# EAGLE design LedEsp32_rev1 (EAGLE 9.6.2)
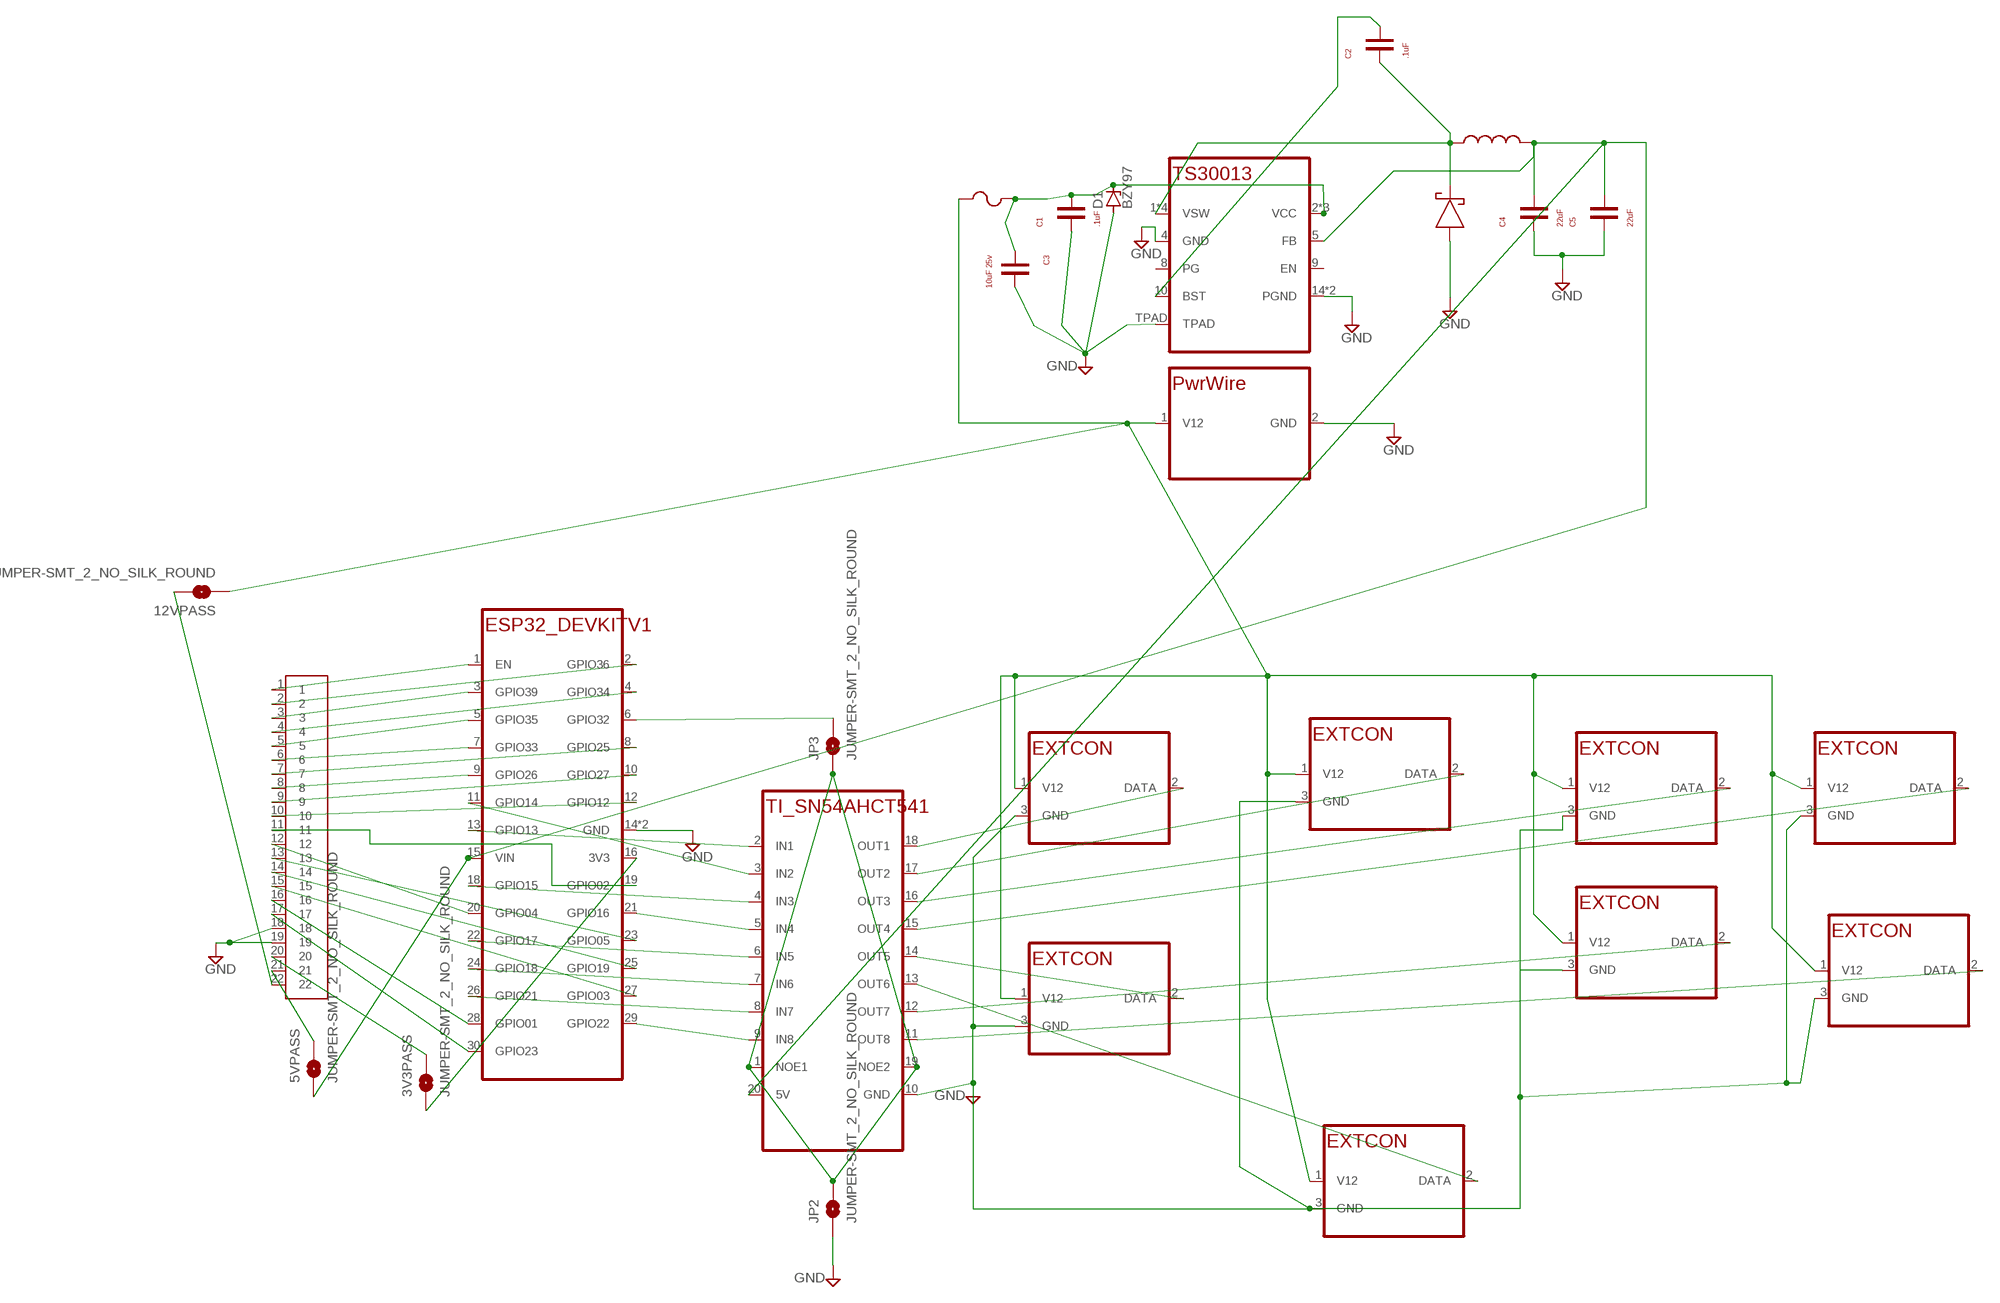
[diagram p0: schematic, sheet 1]

## Parts
3V3PASS  JUMPER-SMT_2_NO_SILK_ROUND  [SMT-JUMPER_2_NO_SILK_ROUND]
5VPASS  JUMPER-SMT_2_NO_SILK_ROUND  [SMT-JUMPER_2_NO_SILK_ROUND]
12VPASS  JUMPER-SMT_2_NO_SILK_ROUND  [SMT-JUMPER_2_NO_SILK_ROUND]
C1  .1uF  CAPACITOR_NONPOLARC0603  [C0603]
C2  .1uF  CAPACITOR_NONPOLARC0603  [C0603]
C3  10uF 25v  CL31A106MAHNNNEC1206  [C1206]
C4  22uF  GRM188R61A226ME15DC0603  [C0603]
C5  22uF  GRM188R61A226ME15DC0603  [C0603]
D1  BZY97  [F126Z12]
D2  LS54LS54  [LS54]
F1  3A  FUSER0603  [R0603]
IC1  TS30013QFN16  [QFN16]
JP2  JUMPER-SMT_2_NO_SILK_ROUND  [SMT-JUMPER_2_NO_SILK_ROUND]
JP3  JUMPER-SMT_2_NO_SILK_ROUND  [SMT-JUMPER_2_NO_SILK_ROUND]
L1  SRN5040TA-4R7MSRN5040TA  [SRN5040TA]
LC$0  EXTCONEXTCONDEVINST  [EXTCON]
LC$1  EXTCONEXTCONDEVINST  [EXTCON]
LC$2  EXTCONEXTCONDEVINST  [EXTCON]
LC$3  EXTCONEXTCONDEVINST  [EXTCON]
LC$4  EXTCONEXTCONDEVINST  [EXTCON]
LC$5  EXTCONEXTCONDEVINST  [EXTCON]
LC$6  EXTCONEXTCONDEVINST  [EXTCON]
LC$7  EXTCONEXTCONDEVINST  [EXTCON]
U$1  ESP32_DEVKITV1ESP32_DEVKITV1DEVINST  [ESP32_DEVKITV1]
U$2  TI_SN54AHCT541SO20WDEVINST  [SO20W]
U$3  1X22THM  [1X22]
U$8  PWRWIREDPWRWIREP  [PWRWIREP]

## Nets
GND: C1.1 C3.2 C4.1 C5.1 D1.A D2.1 IC1.4(GND) IC1.14(PGND) IC1.15(PGND) IC1.TPAD JP2.1 LC$0.3(GND) LC$1.3(GND) LC$2.3(GND) LC$3.3(GND) LC$4.3(GND) LC$5.3(GND) LC$6.3(GND) LC$7.3(GND) U$1.14(GND) U$1.17(GND) U$2.10(GND) U$3.18 U$3.19 U$8.2(GND)
N$1: LC$0.2(DATA) U$2.18(OUT1)
N$2: U$1.19(GPIO02) U$3.11
N$3: C2.1 D2.2 IC1.1(VSW) IC1.12(VSW) IC1.13(VSW) IC1.16(VSW) L1.1
N$5: C2.2 IC1.10(BST)
N$6: LC$1.2(DATA) U$2.17(OUT2)
N$7: LC$2.2(DATA) U$2.16(OUT3)
N$8: LC$3.2(DATA) U$2.15(OUT4)
N$9: LC$4.2(DATA) U$2.14(OUT5)
N$10: LC$5.2(DATA) U$2.13(OUT6)
N$11: LC$6.2(DATA) U$2.12(OUT7)
N$12: LC$7.2(DATA) U$2.11(OUT8)
N$13: U$1.11(GPIO14) U$2.3(IN2)
N$14: U$1.13(GPIO13) U$2.2(IN1)
N$15: U$1.18(GPIO15) U$2.4(IN3)
N$16: U$1.21(GPIO16) U$2.5(IN4)
N$17: U$1.22(GPIO17) U$2.6(IN5)
N$18: U$1.24(GPIO18) U$2.7(IN6)
N$19: U$1.26(GPIO21) U$2.8(IN7)
N$20: U$1.29(GPIO22) U$2.9(IN8)
N$21: JP2.2 JP3.1 U$2.1(NOE1) U$2.19(NOE2)
N$22: JP3.2 U$1.6(GPIO32)
N$23: U$1.1(EN) U$3.1
N$24: U$1.2(GPIO36) U$3.2
N$25: U$1.3(GPIO39) U$3.3
N$26: U$1.4(GPIO34) U$3.4
N$27: U$1.5(GPIO35) U$3.5
N$28: U$1.7(GPIO33) U$3.6
N$29: U$1.8(GPIO25) U$3.7
N$30: U$1.9(GPIO26) U$3.8
N$31: U$1.10(GPIO27) U$3.9
N$32: U$1.12(GPIO12) U$3.10
N$34: U$1.20(GPIO04) U$3.12
N$35: U$1.23(GPIO05) U$3.13
N$36: U$1.25(GPIO19) U$3.14
N$37: U$1.27(GPIO03) U$3.15
N$38: U$1.28(GPIO01) U$3.16
N$39: U$1.30(GPIO23) U$3.17
N$40: 5VPASS.2 U$3.21
N$41: 12VPASS.2 U$3.22
N$42: 3V3PASS.1 U$1.16(3V3)
N$43: 3V3PASS.2 U$3.20
N$44: C1.2 C3.1 D1.C F1.2 IC1.2(VCC) IC1.3(VCC) IC1.11(VCC)
V5: 5VPASS.1 C4.2 C5.2 IC1.5(FB) L1.2 U$1.15(VIN) U$2.20(5V)
VCC: 12VPASS.1 F1.1 LC$0.1(V12) LC$1.1(V12) LC$2.1(V12) LC$3.1(V12) LC$4.1(V12) LC$5.1(V12) LC$6.1(V12) LC$7.1(V12) U$8.1(V12)
Unconnected: IC1.8(PG) IC1.9(EN)

## Library data of the parts
3V3PASS 5VPASS 12VPASS JP2 JP3 = SparkFun-Jumpers:JUMPER-SMT_2_NO: Normally open jumper This jumper has two pads in close proximity to each other. Apply solder to close the connection. Round pads are easier to solder for beginners, but are a lot larger. SparkFun Product that uses the round pads: SparkFun EL Sequencer <https://www.sparkfun.com/products/12781>
C1 C2 = ledinlinesupply:CAPACITOR_NONPOLAR
C3 = ledinlinesupply:CL31A106MAHNNNE
C4 C5 = ledinlinesupply:GRM188R61A226ME15D
D1 = diode:BZY97: Z DIODE
D2 = ledinlinesupply:LS54
F1 = ledinlinesupply:FUSE
IC1 = ledinlinesupply:TS30013
L1 = ledinlinesupply:SRN5040TA-4R7M
LC$0 LC$1-LC$7 = ledinlinesupply:EXTCON
U$1 = esp32:ESP32_DEVKITV1
U$2 = esp32:TI_SN54AHCT541
U$3 = adafruit:1X22
U$8 = ledinlinesupply:PWRWIRED

## Board
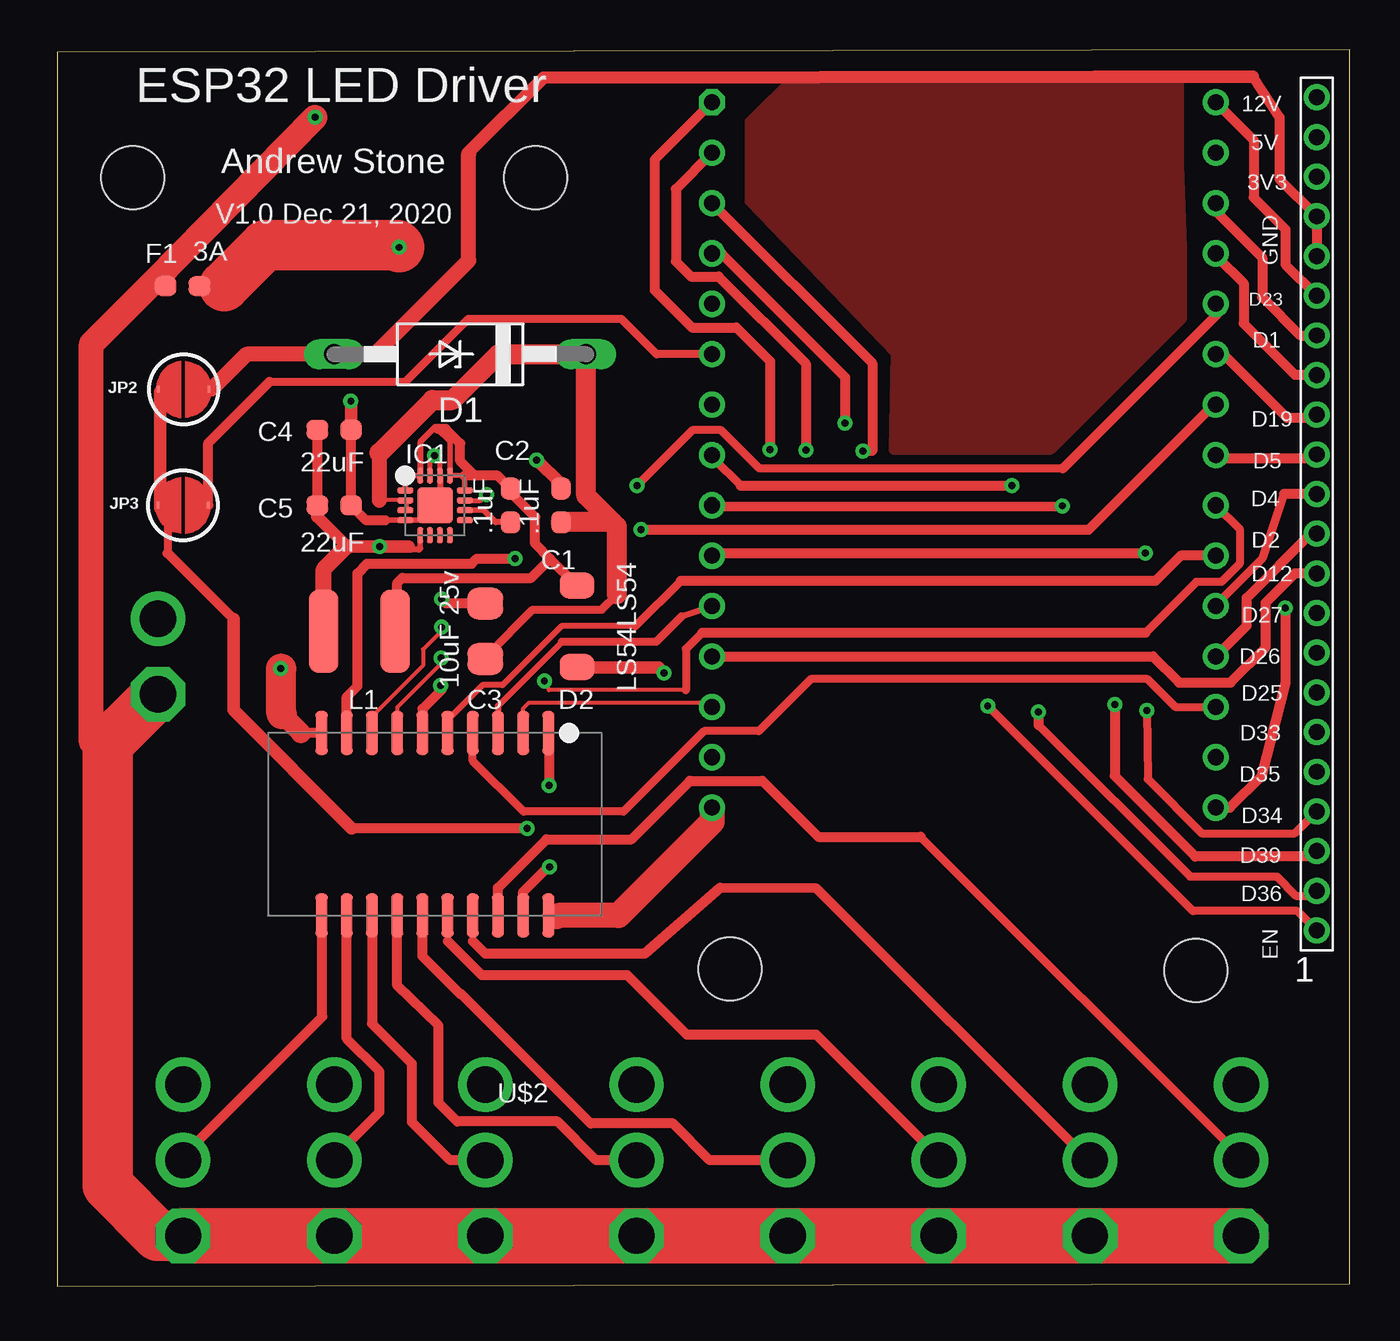
[diagram p1: board, top side]
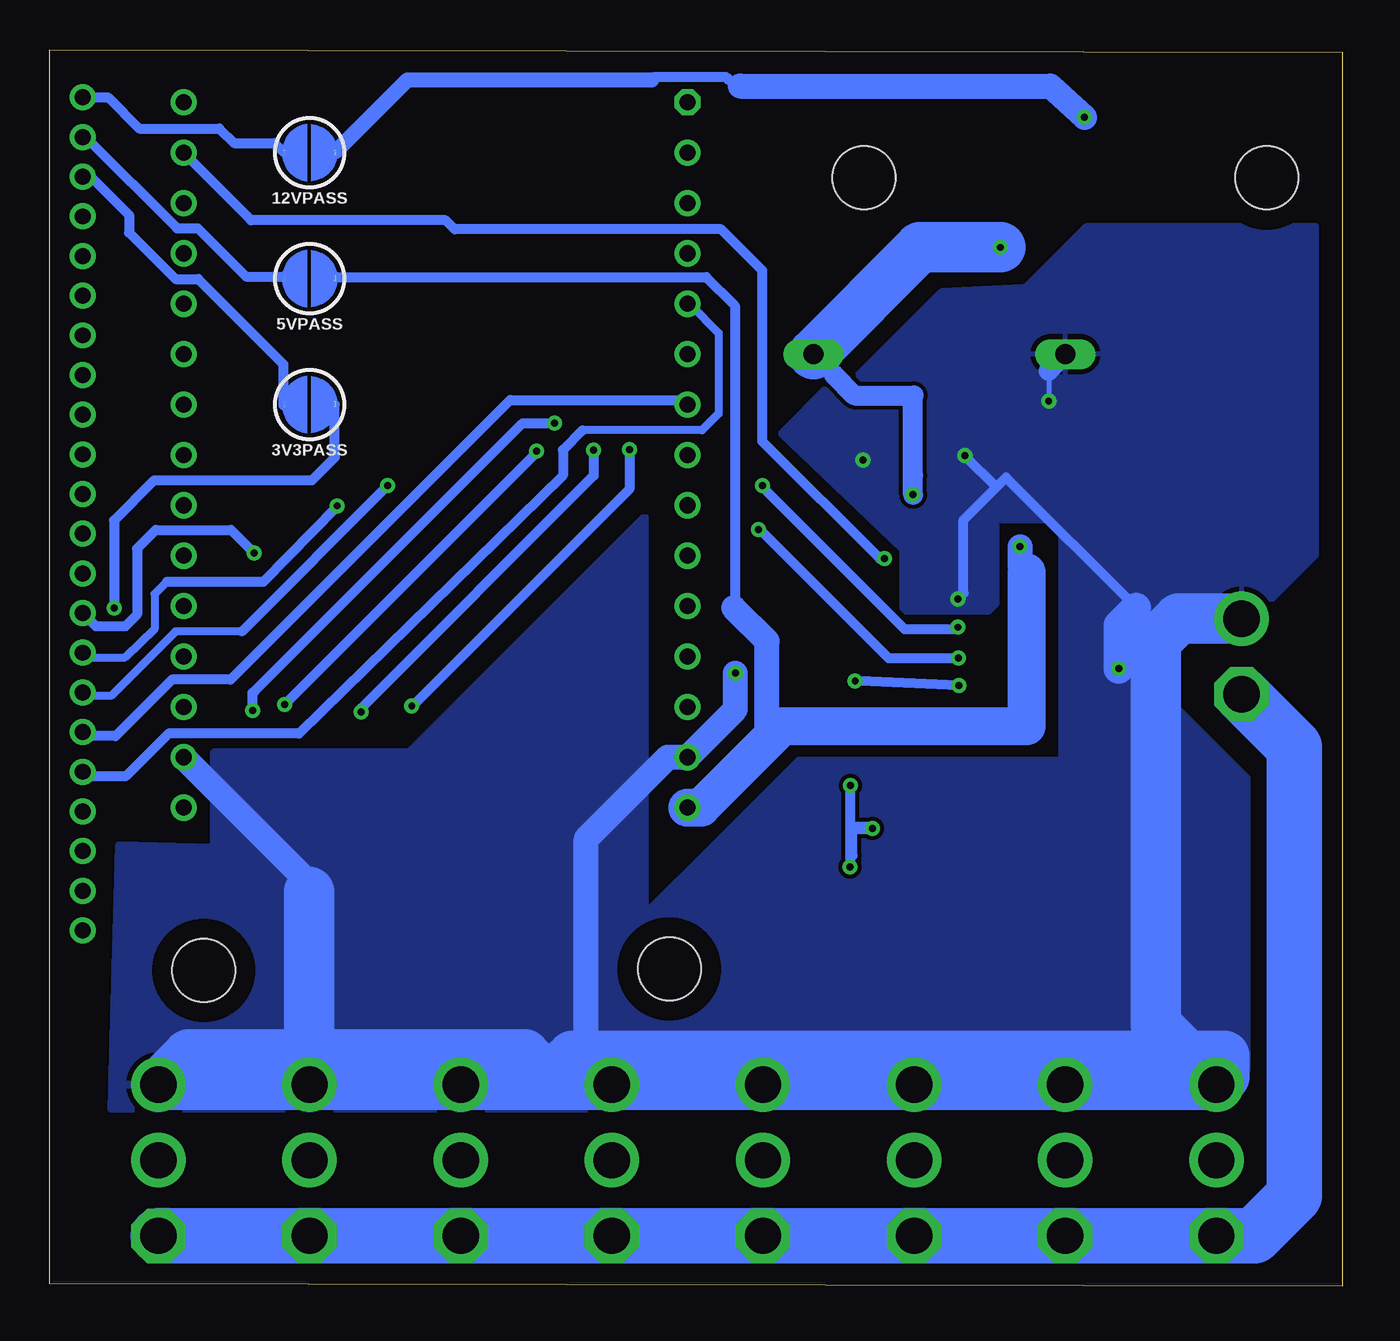
[diagram p2: board, bottom side, seen from below]

Size 65.18 x 62.35 mm. Coordinates in mm from the lower left corner, seen from the top.
Outline: 0,0 65.18,0.13 65.18,62.35 0,62.22 0,0
Copper layers (1*16): Top 0.035mm / dielectric 1.5mm / Bottom 0.035mm
Design rules "default *": minimum track width 8mil, minimum drill 0.35mm, track to track 8mil, track to pad 8mil, pad to pad 8mil, via to via 8mil, smd to smd 8mil, copper to edge 40mil, drill to drill 6mil, minimum pad ring 10mil, minimum via ring 8mil, stop-mask expansion 4mil, vias tented up to drill 0mil, thermal gap 10mil
Holes 3.17 mm at 3.81,55.88 24.13,55.88 33.93,16 57.4,15.93

### Footprints (pad centres in the part's own frame; a part is rotated, then mirrored left to right if it is on the bottom)
SMT-JUMPER_2_NO_SILK_ROUND = smd 0.152 x 0.305: 1 -1.27,0; 2 1.27,0
C0603 = smd 1.1 x 1: 1 -0.85,0; 2 0.85,0
C1206 = smd 1.6 x 1.8: 1 -1.4,0; 2 1.4,0
F126Z12 = drill 1.016 long: A 6.35,0; C -6.35,0
LS54 = smd 1.3 x 1.75: 1 -2.05,0; 2 2.05,0
R0603 = smd 1.1 x 1: 1 -0.85,0; 2 0.85,0
QFN16 = smd 0.8 x 0.3: 1 -1.5,0.75; 2 -1.5,0.25; 3 -1.5,-0.25; 4 -1.5,-0.75; 9 1.5,-0.75; 10 1.5,-0.25; 11 1.5,0.25; 12 1.5,0.75 | smd 0.3 x 0.8: 5 -0.75,-1.5; 6 -0.25,-1.5; 7 0.25,-1.5; 8 0.75,-1.5; 13 0.75,1.5; 14 0.25,1.5; 15 -0.25,1.5; 16 -0.75,1.5 | smd 1.8 x 1.8: TPAD 0,0
SRN5040TA = smd 1.5 x 4.2: 1 -1.8,0; 2 1.8,0
EXTCON = drill 1.829 octagon: 1 -3.81,0 | drill 1.829: 2 0,0; 3 3.81,0
ESP32_DEVKITV1 = drill 0.813 octagon: 1 -17.78,-12.7 | drill 0.813: 2 -15.24,-12.7; 3 -12.7,-12.7; 4 -10.16,-12.7; 5 -7.62,-12.7; 6 -5.08,-12.7; 7 -2.54,-12.7; 8 0,-12.7; 9 2.54,-12.7; 10 5.08,-12.7; 11 7.62,-12.7; 12 10.16,-12.7; 13 12.7,-12.7; 14 15.24,-12.7; 15 17.78,-12.7; 16 17.78,12.7; 17 15.24,12.7; 18 12.7,12.7; 19 10.16,12.7; 20 7.62,12.7; 21 5.08,12.7; 22 2.54,12.7; 23 0,12.7; 24 -2.54,12.7; 25 -5.08,12.7; 26 -7.62,12.7; 27 -10.16,12.7; 28 -12.7,12.7; 29 -15.24,12.7; 30 -17.78,12.7
SO20W = smd 0.6 x 2.2: 1 -5.715,-4.6; 2 -4.445,-4.6; 3 -3.175,-4.6; 4 -1.905,-4.6; 5 -0.635,-4.6; 6 0.635,-4.6; 7 1.905,-4.6; 8 3.175,-4.6; 9 4.445,-4.6; 10 5.715,-4.6; 11 5.715,4.6; 12 4.445,4.6; 13 3.175,4.6; 14 1.905,4.6; 15 0.635,4.6; 16 -0.635,4.6; 17 -1.905,4.6; 18 -3.175,4.6; 19 -4.445,4.6; 20 -5.715,4.6
1X22 = drill 0.8: 1 -21,0; 2 -19,0; 3 -17,0; 4 -15,0; 5 -13,0; 6 -11,0; 7 -9,0; 8 -7,0; 9 -5,0; 10 -3,0; 11 -1,0; 12 1,0; 13 3,0; 14 5,0; 15 7,0; 16 9,0; 17 11,0; 18 13,0; 19 15,0; 20 17,0; 21 19,0; 22 21,0
PWRWIREP = drill 1.829 octagon: 1 -1.905,0 | drill 1.829: 2 1.905,0

### Placement (x,y rotation side)
3V3PASS  52.07,44.45 180 bottom
5VPASS  52.07,50.8 180 bottom
12VPASS  52.07,57.15 180 bottom
C1  25.4,39.37 270 top
C2  22.86,39.37 270 top
C3  21.59,33.02 90 top
C4  13.97,43.18 180 top
C5  13.97,39.37 180 top
D1  20.32,46.99 180 top
D2  26.21,33.27 90 top
F1  6.32,50.42 0 top
IC1  19.05,39.37 0 top
JP2  6.38,45.21 180 top
JP3  6.35,39.37 0 top
L1  15.24,33.02 180 top
LC$0  59.69,6.35 90 top
LC$1  52.07,6.35 90 top
LC$2  44.45,6.35 90 top
LC$3  36.83,6.35 90 top
LC$4  29.21,6.35 90 top
LC$5  21.59,6.35 90 top
LC$6  13.97,6.35 90 top
LC$7  6.35,6.35 90 top
U$1  45.72,41.91 270 top
U$2  19.05,23.29 180 top
U$3  63.5,38.94 90 top
U$8  5.08,31.75 90 top

### Tracks (layer width: path | path; a pad name or v marks a point on that pad's centre or on a via)
GND  (via drill 0.35)
  Top 0.203: 26.23,31.19 D2.1 | 7.8,45.24 7.67,45.24 JP2.1
  Top 0.254: IC1.15 18.8,41.66 v19.03,41.89 19.3,41.52 IC1.14
  Top 0.279: 18.71,38.62 IC1.4 16.55,38.62
  Top 0.305: IC1.14 19.3,39.62 19.15,39.47 | 19.15,39.47 IC1.TPAD | 19.15,39.47 19.15,39.06 18.71,38.62 | 16.55,38.62 16.54,38.61
  Top 0.508: 16.54,38.61 15.58,38.61 C5.1 C4.1 | U$3.18 U$3.19 61.62,55.82 61.62,58.95 60.28,60.99 | C3.2 19.61,34.42 v19.38,34.65 | U$2.10 12.3,27.89 12.29,27.89
  Top 0.61: C1.1 25.4,40.44 v24.18,41.66
  Top 0.635: v30.61,30.91 30.33,31.19 26.23,31.19 | 20.75,57.1 20.75,57.17 24.51,60.93 52.35,60.99 60.28,60.99 | v14.81,44.63 14.82,44.62 C4.1
  Top 0.762: 7.8,45.24 9.55,46.99 D1.A 16.03,46.99 20.75,51.71 20.75,57.1
  Top 1.016: 12.29,27.89 11.34,28.84
  Top 1.524: 11.34,28.84 11.3,28.88 11.3,31.14 v11.28,31.14
  Bottom 0.254: 14.81,46.15 v14.81,44.63
  Bottom 0.508: v19.03,41.89 19.03,41.86 17.45,40.28 | 10.39,34.21 16.95,40.78 17.45,40.28 | 17.45,40.28 19.1,38.63 19.1,34.92 v19.38,34.65
  Bottom 1.016: D1.A 14.81,46.15
  Bottom 1.27: U$1.17 51.64,19.89 52.09,19.89 | v30.61,30.91 30.61,29.08 U$1.14 34.01,26.67 38.12,22.55 38.12,10.16
  Bottom 1.524: v11.28,31.14 11.28,33.33 10.39,34.21
  Bottom 2.54: U$8.2 8.26,33.66 9.4,32.51 9.4,13.21 LC$7.3 | LC$7.3 LC$6.3 LC$5.3 LC$4.3 LC$3.3 | LC$3.3 38.12,10.16 39.7,10.16 41.22,11.68 58.17,11.68 LC$0.3 LC$1.3 | LC$1.3 LC$2.3 LC$3.3 | LC$1.3 52.09,10.18 52.09,19.89 | LC$7.3 5.94,10.57 5.94,11.61 38.81,11.61 39.04,11.38 37.82,10.16 LC$3.3
  pour Top: 42.26,47.05 42.16,42.16 42.19,42.19 50.11,42.19 56.72,48.79 56.72,52.32 56.57,56.57 56.57,61.01 37.21,61.01 34.9,58.7 34.9,54.72
  pour Bottom: 4.04,34.11 1.3,36.86 1.3,53.47 12.93,53.47 16.08,50.32 16.07,50.4 20.2,50.19 25.05,45.34 26.02,45.34 28.36,42.99 22.23,37.14 22.23,34.21 22.01,34 17.82,34 17.42,34.39 17.42,38.61 14.25,38.61 8.43,32.79 4.88,32.79 4.8,32.72
  pour Bottom: 14.22,38.53 14.22,26.57 27.43,26.57 39.55,14.45 39.55,10.59 39.45,10.49 4.75,10.49 4.75,25.6 8.48,29.34 8.48,32.79
  pour Bottom: 35.18,38.79 35.18,18.72 36.35,17.55 36.35,10.08 37.49,8.94 62.06,8.94 61.67,22.24 56.87,22.11 56.87,26.92 47.05,26.92 47.05,26.91
N$1
  Top 0.203: 59.69,6.5 LC$0.2
  Top 0.406: 43.54,22.66 59.69,6.5
  Top 0.508: U$2.18 22.23,20.09 24.67,22.53 28.96,22.53 31.9,25.48 35.56,25.48 38.38,22.66 43.54,22.66
N$2
  Top 0.508: U$3.11 63.21,37.94 59.97,34.7 59.97,33.3 U$1.19
N$3
  Top 0.203: 22.91,40.13 C2.1
  Top 0.254: 20.52,40.87 IC1.13
  Top 0.279: 20.55,40.84 IC1.12 | IC1.16 17.55,40.87 | 17.55,40.87 IC1.1 | IC1.13 19.8,42.61
  Top 0.305: 20.52,40.87 20.55,40.84 | 17.55,40.87 | 19.8,42.61 19.19,43.22 19.07,43.33 18.3,42.56 IC1.16
  Top 0.508: L1.1 17.14,33.12 17.14,35.46 17.4,35.71 23.9,35.71 24.86,36.67 | D2.2 24.86,36.67 | 24.86,36.67 24.1,37.44 24.1,38.79 22.91,39.97 22.91,40.13 | C2.1 22.21,40.87 21.06,40.87 | 21.06,40.87 20.52,40.87 | 21.06,40.87 20.32,41.61 20.32,42.49 19.6,43.22 19.19,43.22
N$5
  Top 0.279: 21.51,39.12 IC1.10
  Top 0.305: C2.2 22.11,38.52 21.51,39.12
N$6
  Top 0.203: 20.96,17.4 U$2.17 | 51.92,6.45 51.95,6.47 LC$1.2
  Top 0.508: 20.96,17.4 21.59,16.76 29.62,16.76 33.42,20.09 38.29,20.05 51.92,6.45
N$7
  Top 0.203: 19.68,17.4 U$2.16 | 44.45,6.5 LC$2.2
  Top 0.508: 19.68,17.4 21.41,15.67 28.75,15.67 31.75,12.68 38.28,12.68 44.45,6.5
N$8
  Top 0.508: LC$3.2 32.89,6.35 31.04,8.2 26.9,8.2 20.37,14.73 20.32,14.73 18.41,16.64 U$2.15
N$9
  Top 0.508: LC$4.2 27.18,6.35 25.22,8.31 20.17,8.31 19.23,9.25 19.23,13.14 17.14,15.16 U$2.14
N$10
  Top 0.508: U$2.13 15.88,13.23 17.88,11.23 17.88,8.28 19.81,6.35 LC$5.2
N$11
  Top 0.203: 14.61,17.65 U$2.12 | 13.97,6.5 LC$6.2
  Top 0.508: 14.61,17.65 14.61,12.47 16.26,10.82 16.26,8.79 13.97,6.5
N$12
  Top 0.203: 13.36,18.43 13.34,18.49 U$2.11 | 6.81,7.04 LC$7.2
  Top 0.508: 13.36,18.43 13.36,13.59 6.81,7.04
N$13
  Top 0.305: U$2.3 22.23,29.26 25.45,32.49 | 31.5,33.78 U$1.11
  Top 0.406: 25.45,32.49 30.2,32.49 31.5,33.78
N$14
  Top 0.203: U$2.2 23.5,29.14 23.77,29.42 32.81,29.42 U$1.13
N$15
  Top 0.406: U$2.4 20.96,26.49 23.52,23.93 28.55,23.93 32.61,27.99 35.38,27.99 38,30.61 54.97,30.61 56.36,29.21 U$1.18
N$16
  Top 0.203: 19.86,28.73 19.86,27.96 U$2.5
  Top 0.305: 19.86,28.73 21.44,30.3 22.45,30.3 25.43,33.27 29.16,33.27
  Top 0.406: 31.45,35.56 29.16,33.27
  Top 0.508: 31.45,35.56 55.37,35.56 56.64,36.83 U$1.21
N$17  (via drill 0.35)
  Top 0.203: v24.56,30.5 24.79,30.05 31.7,30.05
  Top 0.406: 54.86,32.94 57.43,35.51 58.7,35.51 59.61,36.42 59.61,38.18 U$1.22 | 32.51,32.94 31.7,32.13 31.7,30.05
  Top 0.508: 54.86,32.94 32.51,32.94 | v19.33,30.28 19.4,30.09 18.41,29.11 U$2.6
  Bottom 0.508: v24.56,30.5 24.36,30.5 v19.33,30.28
N$18  (via drill 0.35)
  Top 0.203: 17.16,27.9 17.16,29.2 19.36,31.39 v19.36,31.67 | 29.5,38.12 v29.44,38.15 | 58.27,44.4 U$1.24
  Top 0.508: 29.5,38.12 51.99,38.12 58.27,44.4 | U$2.7 | U$2.7 17.16,27.9
  Bottom 0.508: v19.36,31.67 22.87,31.67 22.88,31.66 29.36,38.15 v29.44,38.15
N$19  (via drill 0.35)
  Top 0.203: v19.38,33.22 19.38,33.05 18.44,32.11 18.44,31.29 16,28.85 16,27.96 U$2.8
  Top 0.406: v29.23,40.36 32.03,43.16 33.48,43.16 35.41,41.22 50.7,41.22
  Top 0.508: U$1.26 58.42,48.95 50.7,41.22
  Bottom 0.203: 19.48,33.12 v19.38,33.22
  Bottom 0.508: 19.48,33.12 22.07,33.12 29.23,40.28 v29.23,40.36
N$20  (via drill 0.35)
  Top 0.508: U$2.9 14.61,29.72 15.14,30.25 15.14,35.94 15.62,36.42 20.9,36.42 21.16,36.68 v23.09,36.68
  Bottom 0.508: v23.09,36.68 23.32,36.68 29.23,42.6 29.23,51.21 31.32,53.29 44.75,53.29 45.21,53.75 55.02,53.75 U$1.29
N$21  (via drill 0.35)
  Top 0.203: JP3.1 5.36,39.09 5.56,38.89 | 24.79,26.89 24.79,27.87 U$2.1
  Top 0.254: 5.21,45.11 5.66,45.11 5.56,45.21 JP2.2
  Top 0.406: 5.56,38.89 5.56,36.96
  Top 0.508: v23.69,23.07 23.67,23.09 14.86,23.09 | 5.56,36.96 8.89,33.63 | U$2.19 23.5,19.89 24.74,21.13 v24.82,21.13 | 24.79,26.89 v24.79,25.25
  Top 0.635: 5.21,45.11 5.21,39.24 5.36,39.09 | 8.89,33.63 8.89,29.06 14.86,23.09
  Bottom 0.508: v24.79,25.25 24.82,25.22 24.82,21.59 | 24.82,21.59 v24.82,21.13 | 24.82,21.59 24.69,21.71 24.69,23.09
  Bottom 0.635: 24.69,23.09 23.69,23.09 v23.69,23.07
N$22
  Top 0.406: U$1.6 30.23,46.99 28.45,48.77 20.73,48.77 17.55,45.59 10.69,45.59
  Top 0.508: JP3.2 7.62,42.52 10.69,45.59
N$23  (via drill 0.35)
  Top 0.406: U$3.1 62.53,18.91 57.26,18.91 v46.91,29.26
  Top 0.508: U$1.1 30.12,56.79 30.12,50.22 32,48.34 34.24,48.34 35.94,46.63 v35.94,42.19
  Bottom 0.508: v35.94,42.19 35.94,40.18 46.86,29.26 v46.91,29.26
N$24  (via drill 0.35)
  Top 0.203: 63.5,19.68 U$3.2
  Top 0.406: 63.5,19.68 62.46,19.68 61.49,20.65 57.12,20.65 49.48,28.3
  Top 0.508: v49.48,28.96 49.48,28.3 | v37.74,42.16 37.74,46.51 33.35,50.9 31.95,50.9 31.19,51.66 31.19,55.32 U$1.2
  Bottom 0.508: v37.74,42.16 37.74,40.87 49.48,29.13 v49.48,28.96
N$25  (via drill 0.35)
  Top 0.203: U$3.3 63.23,21.67
  Top 0.508: 63.23,21.67 57.38,21.67 53.31,25.73 v53.31,29.34 | v40.61,42.11 41.1,42.11 41.1,46.53 U$1.3
  Bottom 0.508: v53.31,29.34 40.61,42.04 v40.61,42.11
N$26  (via drill 0.35)
  Top 0.406: v54.94,29.03 54.98,25.57 57.71,22.84 62.4,22.84 U$3.4
  Top 0.508: U$1.4 33.5,52.07 39.73,45.82 v39.73,43.51
  Bottom 0.508: v54.94,29.03 54.94,29.93 54.86,29.98 41.33,43.51 v39.73,43.51
N$27
  Bottom 0.203: 63.5,25.7 U$3.5 | 32.87,49.48 U$1.5
  Bottom 0.406: 38.3,43.16 32.28,43.16 31.45,43.99 31.45,48.06 32.87,49.48
  Bottom 0.508: 63.5,25.7 61.34,25.7 59.18,27.86 52.6,27.86 39.29,40.88 39.29,42.16 38.3,43.16
N$28
  Bottom 0.203: 63.5,27.74 U$3.6
  Bottom 0.508: 63.5,27.74 61.85,27.74 59,30.58 56.06,30.58 41.96,44.68 33.25,44.68 U$1.7
N$29  (via drill 0.35)
  Top 0.203: 33.07,41.76 U$1.8
  Top 0.406: 33.07,41.76 34.47,40.36
  Top 0.508: 34.47,40.36 v48.13,40.36
  Bottom 0.203: 63.5,29.77 U$3.7
  Bottom 0.406: 63.5,29.77 62.08,29.77 58.83,33.02 55.47,33.02
  Bottom 0.508: 55.47,33.02 v48.13,40.36
N$30  (via drill 0.35)
  Top 0.203: 33.07,39.32 U$1.9
  Top 0.508: 33.07,39.32 v50.67,39.34
  Bottom 0.406: U$3.8 63.26,31.7 61.36,31.7 59.88,33.12 59.88,34.9 59.26,35.52
  Bottom 0.508: v50.67,39.34 50.67,39.32 54.39,35.52 59.26,35.52
N$31  (via drill 0.35)
  Top 0.203: U$1.10 33.12,36.93 | 54.84,36.93 v54.86,36.96
  Top 0.508: 54.84,36.93 33.12,36.93
  Bottom 0.508: v54.86,36.96 56.03,38.12 59.82,38.12 60.76,37.18 60.76,33.87 61.35,33.28 62.84,33.28 U$3.9
N$32
  Top 0.508: U$3.10 62.4,35.94 60.93,34.47 60.93,32.21 59.16,30.43 56.57,30.43 55.24,31.75 U$1.12
N$34
  Top 0.406: 61.84,39.94 60.76,36.68 58.42,34.34 U$1.20
  Top 0.508: U$3.12 61.84,39.94
N$35
  Top 0.203: 63.5,41.76 U$3.13 | 58.47,41.76 U$1.23
  Top 0.508: 58.47,41.76 63.5,41.76
N$36
  Top 0.203: 63.5,43.79 U$3.14
  Top 0.508: 63.5,43.79 62,43.79 58.8,46.99 U$1.25
N$37
  Top 0.203: 58.47,51.92 U$1.27
  Top 0.508: U$3.15 62.42,45.94 59.82,48.54 59.82,50.57 58.47,51.92
N$38
  Top 0.203: 58.47,54.56 U$1.28
  Top 0.508: U$3.16 62.68,47.94 60.76,49.86 60.76,51.87 58.47,54.15 58.47,54.56
N$39
  Top 0.508: U$3.17 61.92,51.51 61.92,53.29 60.32,54.89 60.32,57.78 U$1.30
N$40
  Bottom 0.203: U$3.21 63.35,57.94 | 53.39,50.9 5VPASS.2
  Bottom 0.508: 53.39,50.9 55.27,50.9 57.71,53.34 58.75,53.34 63.35,57.94
N$41
  Bottom 0.508: U$3.22 62.22,59.94 60.65,58.37 56.62,58.37 55.88,57.63 53.82,57.63 12VPASS.2
N$42  (via drill 0.35)
  Top 0.508: v61.92,34.19 61.92,30.4 60.71,25.71 59.13,24.13 U$1.16
  Bottom 0.508: v61.92,34.19 61.92,38.61 59.89,40.64 51.94,40.64 50.8,41.78 3V3PASS.1
N$43
  Bottom 0.203: 53.39,44.4 3V3PASS.2 | 63.1,55.94 U$3.20
  Bottom 0.508: 53.39,44.4 53.39,46.48 57.68,50.77 58.83,50.77 61.16,53.11 61.16,54 63.1,55.94
N$44  (via drill 0.35)
  Top 0.203: 21.72,31.86 C3.1 | IC1.3 17.63,39.12 17.63,39.52 IC1.2 16.26,39.62
  Top 0.254: IC1.11 21.33,39.62 21.62,39.9 v21.64,39.9
  Top 0.406: 28.22,34.87 27.46,34.11 23.98,34.11 21.72,31.86
  Top 0.61: 28.22,38.3 28,38.52
  Top 0.762: 16.26,39.62 16.26,42.01
  Top 1.016: 28.22,34.87 28.22,38.3 | F1.2 8.42,50.42 | C1.2 28,38.52 26.67,39.85 D1.C 22.25,46.99 19.94,44.68 18.92,44.68 16.26,42.01
  Top 2.54: 8.42,50.42 10.48,52.48 17.14,52.48 v17.25,52.38
  Bottom 0.254: 21.64,44.88 21.62,44.91
  Bottom 0.762: D1.C 25.64,45.96
  Bottom 1.016: 25.64,45.96 24.59,44.91 21.62,44.91 | v21.64,39.9 21.64,40.89 21.64,44.88
  Bottom 2.54: v17.25,52.38 21.29,52.38 D1.C
V5  (via drill 0.35)
  Top 0.203: 14.58,37.29 14.63,37.29
  Top 0.279: IC1.5 18.3,37.2
  Top 0.305: 18.3,37.2 18.24,37.13 17.87,37.13 17.72,37.29
  Top 0.508: C4.2 C5.2
  Top 0.635: 17.72,37.29 v16.26,37.29 14.63,37.29 13.12,38.8 C5.2 | 25.2,18.64 24.81,18.64 U$2.20
  Top 0.813: L1.2 13.44,36.15 14.58,37.29
  Top 1.27: U$1.15 33.02,23.42 28.3,18.69 25.25,18.69 25.2,18.64
  Bottom 0.508: 5VPASS.1 50.72,50.88 32.08,50.88 30.63,49.43 30.63,34.27 30.69,34.2
  Bottom 1.27: v16.26,37.29 16.26,36.32 15.93,35.99 | U$1.15 32.46,24.13 29.23,27.36 29.01,27.36 29.01,32.52 30.69,34.2
  Bottom 1.905: 15.93,35.99 15.93,28.24 28.22,28.24 32.33,24.13 U$1.15
VCC  (via drill 0.35)
  Top 0.203: LC$3.1 36.93,2.64 36.93,2.54 | LC$1.1 52.17,2.64 52.17,2.54
  Top 0.254: F1.1 5.16,50.42 4.9,50.67
  Top 1.27: v13.01,58.93 4.9,50.67 1.73,47.5 1.73,27.43 4.14,29.84 U$8.1
  Top 2.54: LC$7.1 5.08,2.54 2.54,5.08 2.54,27.3 U$8.1 | LC$3.1 36.93,2.54 | LC$1.1 52.17,2.54
  Top 2.794: LC$3.1 LC$6.1 LC$7.1 | 36.93,2.54 LC$2.1 LC$1.1 | 52.17,2.54 LC$0.1
  Bottom 0.203: 12VPASS.1 50.75,57.2
  Bottom 0.508: 34.82,60.82 34.67,60.98 31.08,60.98 30.89,60.78 30.63,60.78 30.35,60.5
  Bottom 0.762: 50.75,57.2 47.13,60.82 34.82,60.82
  Bottom 1.27: v13.01,58.93 14.73,60.5 30.35,60.5
  Bottom 2.54: LC$7.1 14.2,2.54 | LC$5.1 LC$4.1
  Bottom 2.794: LC$0.1 LC$5.1 14.2,2.54 4.43,2.54 2.41,4.56 2.41,27.18 U$8.1

### Text on the board
tPlace: ESP32 LED Driver | 12V | Andrew Stone | V1.0 Dec 21, 2020
tNames: 5V | 3V3 | GND | D23 | D1 | D19 | D5 | D4 | D2 | D12 | D27 | D26 | D25 | D33 | D35 | D34 | D39 | D36 | EN